# EAGLE design Adafruit BMP280 (EAGLE 9.4.2)
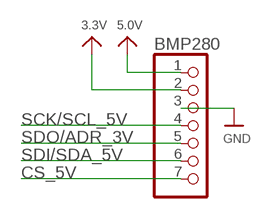
[diagram p0: schematic, sheet 1]

## Parts
BMP280  HEADER-1X770MIL  [1X07_ROUND_70]

## Nets
3.3V: BMP280.2
5.0V: BMP280.1
CS_5V: BMP280.7
GND: BMP280.3
SCK/SCL_5V: BMP280.4
SDI/SDA_5V: BMP280.6
SDO/ADR_3V: BMP280.5

## Library data of the parts
BMP280 = microbuilder:HEADER-1X7: PIN HEADER

## Board
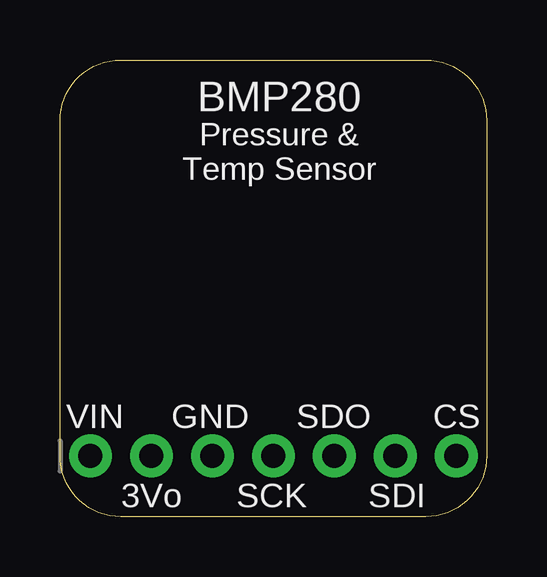
[diagram p1: board, top side]
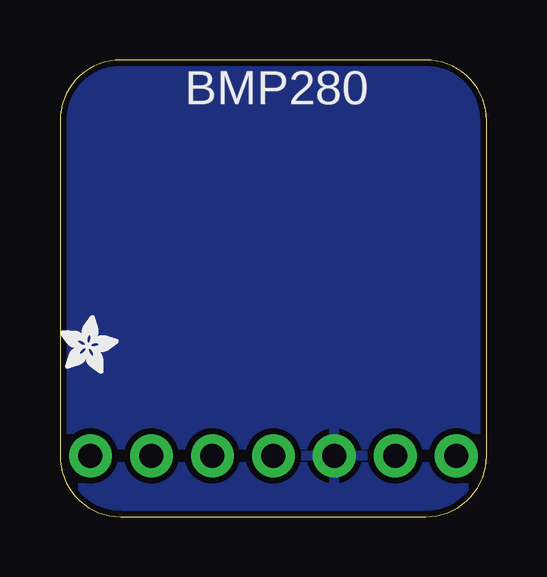
[diagram p2: board, bottom side, seen from below]

Size 17.78 x 19.05 mm. Coordinates in mm from the lower left corner, seen from the top.
Outline: 15.24,0 2.54,0 arc-90 0,2.54 0,16.51 arc-90 2.54,19.05 15.24,19.05 arc-90 17.78,16.51 17.78,2.54 arc-90 15.24,0
Copper layers (1*16): Top 0.035mm / dielectric 1.5mm / Bottom 0.035mm
Design rules "adafruit": minimum track width 8mil, minimum drill 15.5mil, track to track 8mil, track to pad 8mil, pad to pad 8mil, via to via 8mil, smd to smd 8mil, copper to edge 10mil, drill to drill 8mil, minimum pad ring 10mil, minimum via ring 8mil, stop-mask expansion 2mil, vias tented up to drill 20mil, thermal gap 10mil

### Footprints (pad centres in the part's own frame; a part is rotated, then mirrored left to right if it is on the bottom)
1X07_ROUND_70 = drill 1 pad 1.778: 1 -7.62,0; 2 -5.08,0; 3 -2.54,0; 4 0,0; 5 2.54,0; 6 5.08,0; 7 7.62,0

### Placement (x,y rotation side)
BMP280  8.89,2.54 0 top
U$2  [ADAFRUIT_2.5MM]  17.78,5.97 0 bottom

### Tracks (layer width: path | path; a pad name or v marks a point on that pad's centre or on a via)
GND
  pour Bottom (isolate 0.254): 0,19.05 17.78,19.05 17.91,0 0.13,0

### Text on the board
tPlace: BMP280 | Pressure & / Temp Sensor | VIN | GND | SDO | CS | 3Vo | SCK | SDI
bPlace: BMP280